# EasyEDA Pro project ProPrj_智能视觉集成板-V1.0.epro, board PCB2_1
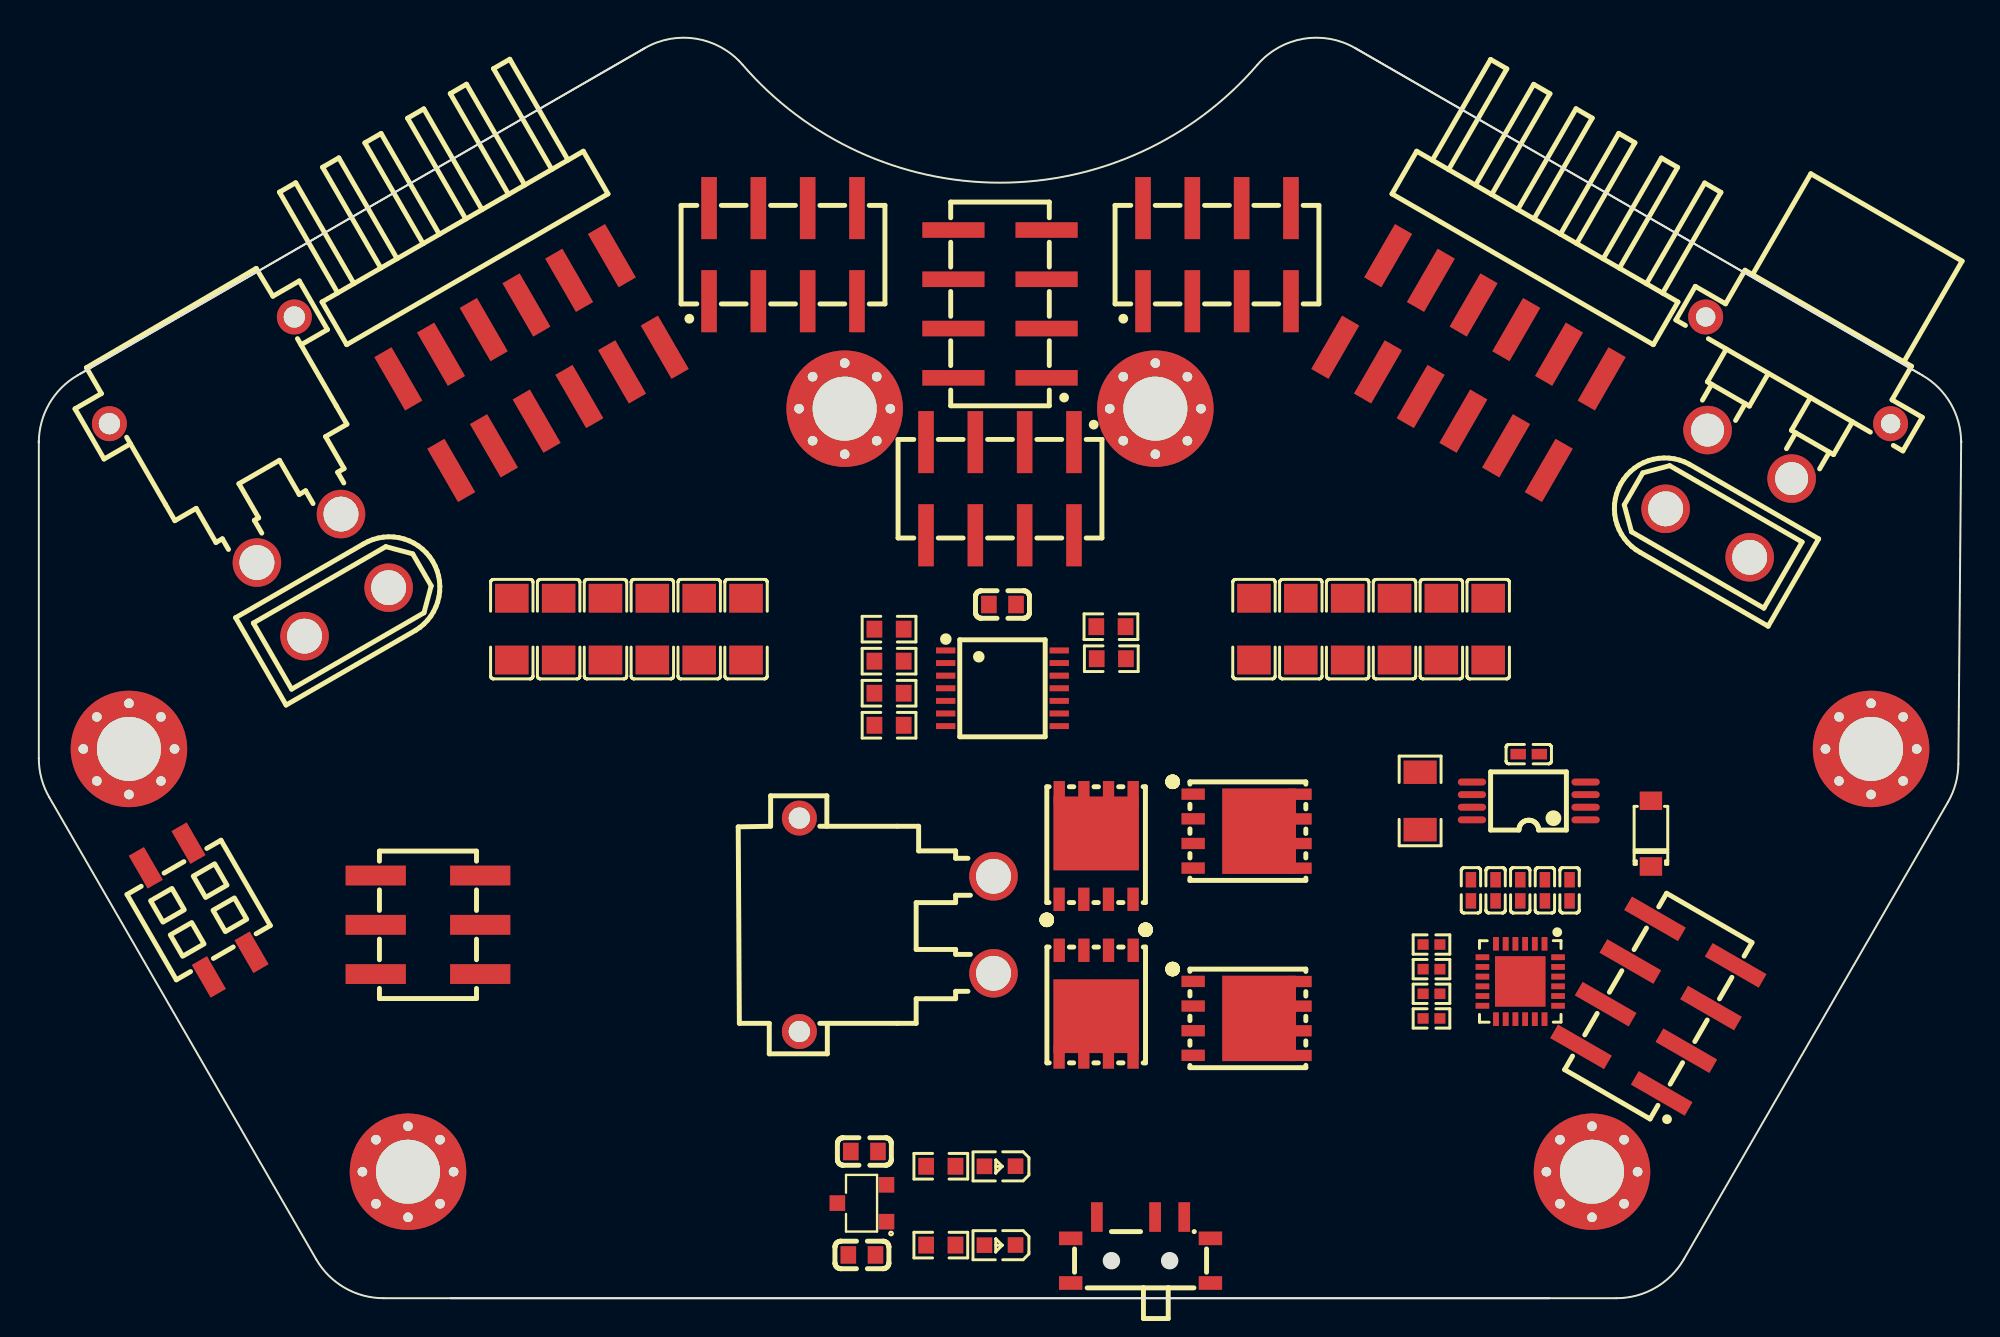
[diagram p12: board, top side]
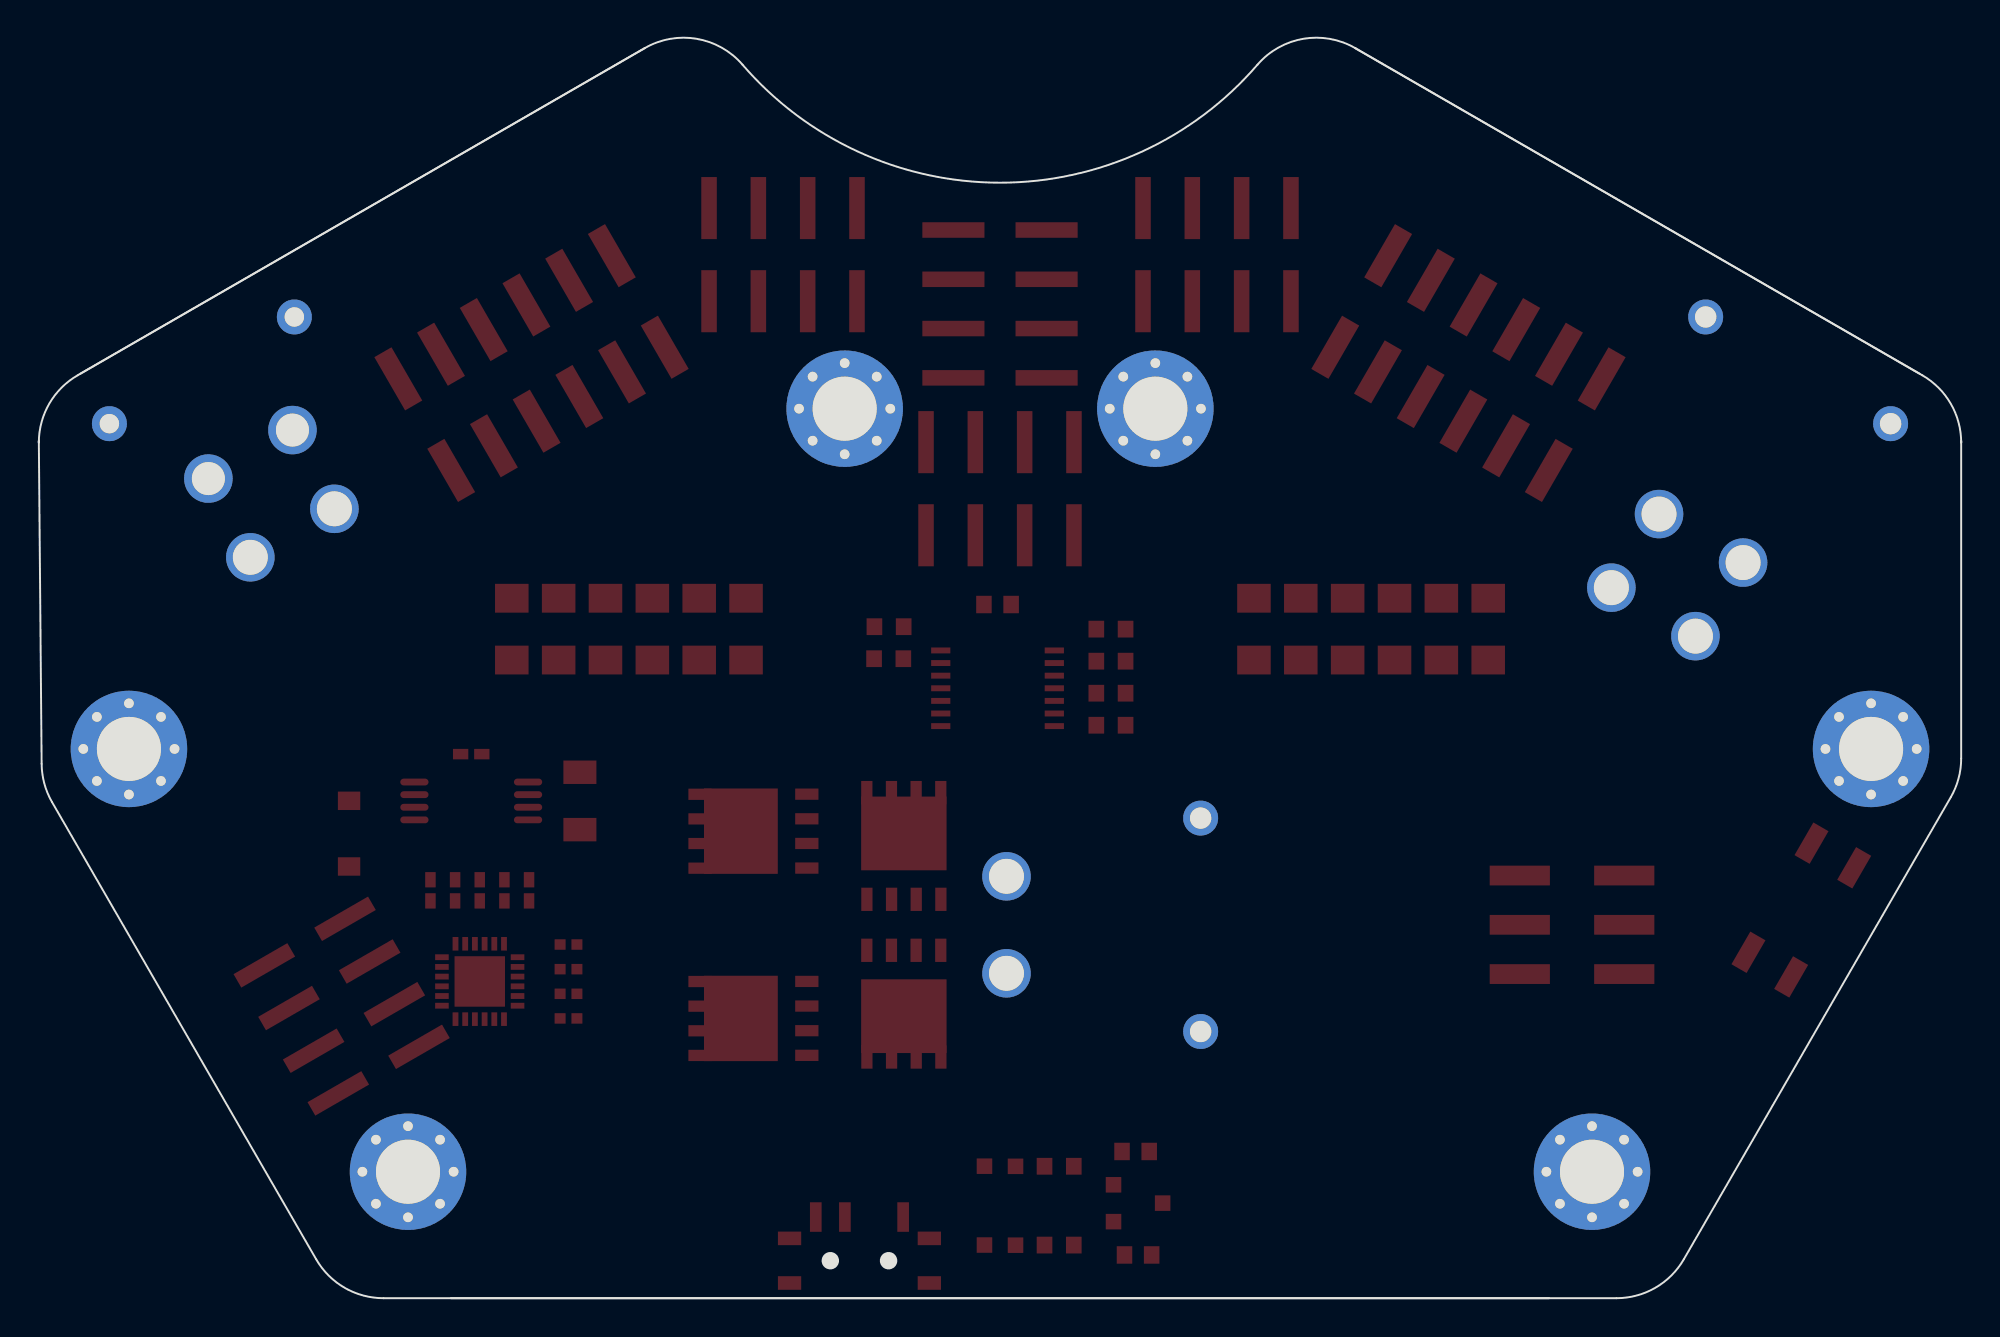
[diagram p13: board, bottom side, seen from below]

Outline 99.01 x 64.92 mm; copper layers: Top Layer, Inner1, Inner2, Inner3, Inner4, Bottom Layer. Coordinates in mm from the lower left corner of the outline.
Outline path: 21.22,0 77.8,0 ; 31.21,64.44 2,47.57 arc(0.54,46.11) 0,44.11 0,44.19 0,27.82 arc(0.14,26.79) 0.54,25.82 14.29,2 arc(15.75,0.54) 17.75,0 81.26,0 arc(83.26,0.54) 84.73,2 98.33,25.57 arc(98.73,26.52) 98.87,27.54 99.01,44.19 99.01,44.11 arc(98.48,46.11) 97.01,47.57 67.8,64.44 ; 31.21,64.44 2.14,47.66 ; 31.21,64.44 arc(33.88,64.92) 36.24,63.58 arc(49.51,57.5) 62.77,63.58 arc(65.13,64.92) 67.8,64.44 ; 67.8,64.44 96.87,47.66
Stack: Top Layer 0.035mm 外层铜厚1oz / Dielectric1 0.0994mm 3313 RC57% 4.2mil / Inner1 0.0152mm 内层铜厚 / Dielectric2 0.55mm 0.55mm H/H No copper / Inner2 0.0152mm 内层铜厚 / Dielectric3 0.1088mm 2116 RC54% 4.9mil / Inner3 0.0152mm 内层铜厚 / Dielectric4 0.55mm 0.55mm H/H No copper / Inner4 0.0152mm 内层铜厚 / Dielectric5 0.0994mm 3313 RC57% 4.2mil / Bottom Layer 0.035mm 外层铜厚1oz

## Design rules (mm)
template: JLCPCB Capability(Two Layers Board)
spacing copperThickness1oz (default): track to track 0.102, other pairs 0.152 to 0.3
spacing copperThickness2oz: track to track 0.203, other pairs 0.152 to 0.3
track width copperThickness1oz (default): min 0.127, default 0.254, max 2.54
track width copperThickness2oz: min 0.203, default 0.254, max 2.54
differential pair differentialPair (default): width min 0.127, default 0.254, max 2.54; gap min 0.152, default 0.152
via viaSize (default): diameter min 0.5, default 0.61, max 10; hole min 0.3, default 0.305, max 6.3

## Placement (name value [footprint] x y rotation side)
C44  1nF  [C0603]  42.4 2.23 180 top
C45  1nF  [C0603]  42.52 7.56 0 top
C94  22uF  [c1206]  69.83 34.49 270 top
C95  22uF  [c1206]  67.41 34.49 270 top
C96  22uF  [c1206]  65 34.49 270 top
C97  22uF  [c1206]  62.59 34.49 270 top
C120  100nF  [C0402]  77.57 21.03 270 top
C121  100nF  [C0402]  78.84 21.03 270 top
C122  100nF  [C0402]  76.3 21.03 270 top
C126  1uF  [C0402]  75.03 21.03 270 top
C127  1uF  [C0402]  73.76 21.03 90 top
C130  100nF  [C0402]  76.74 28.04 0 top
C132  100nF  [C0603]  49.63 35.76 0 top
C133  22uF  [c1206]  74.65 34.49 270 top
C134  22uF  [c1206]  72.24 34.49 270 top
C135  22uF  [c1206]  36.43 34.49 270 top
C136  22uF  [c1206]  34.01 34.49 270 top
C137  22uF  [c1206]  31.6 34.49 270 top
C138  22uF  [c1206]  29.19 34.49 270 top
C139  22uF  [c1206]  26.77 34.49 270 top
C142  22uF  [c1206]  24.36 34.49 270 top
CN6  XT30PW-M30.G.Y  [CONN-TH_XT30PW-M]  10.9 43.5 210 top
CN12  XT30PW-M30.G.Y  [CONN-TH_XT30PW-M]  44.17 19.25 270 top
CN13  PM254-2-04-S-8.5  [HDR-SMD_8P-P2.54-V-F-R2-C4-S7.1]  49.51 41.73 180 top
CN14  PM254-2-04-S-8.5  [HDR-SMD_8P-P2.54-V-F-R2-C4-S7.1]  60.68 53.79 0 top
CN15  PM254-2-04-S-8.5  [HDR-SMD_8P-P2.54-V-F-R2-C4-S7.1]  38.33 53.79 0 top
CN16  PM254-2-04-S-8.5  [HDR-SMD_8P-P2.54-V-F-R2-C4-S7.1]  49.51 51.25 90 top
CN18  PM254-2-04-S-8.5  [HDR-SMD_8P-P2.54-V-F-R2-C4-S7.1]  83.42 15.06 60 top
CN20  XT30UPB-M  [CONN-TH_XT30UPB-M]  85.96 39.44 330 top
CN21  XT30UPB-M  [CONN-TH_XT30UPB-M]  15.85 35.38 210 top
D28  B5819W  [SOD-123_L2.8-W1.8-LS3.7-RD]  83.04 23.95 90 top
J1  -  [M3螺帽]  19.01 6.52 0 top
J2  -  [M3螺帽]  41.51 45.85 0 top
J3  -  [M3螺帽]  57.51 45.85 0 top
J4  -  [M3螺帽]  80 6.52 0 top
J5  -  [M3螺帽]  94.37 28.31 0 top
J6  -  [M3螺帽]  4.64 28.31 0 top
LED4  NCD0603R1  [LED0603-RD_RED]  49.51 6.8 180 top
LED5  NCD0603R1  [LED0603-RD_RED]  49.51 2.74 180 top
Q21  IRFH7440TRPBF  [DFN-8_L5.8-W4.9-P1.27-LS6.0-BL-1]  62.21 24.07 270 top
Q22  IRFH7440TRPBF  [DFN-8_L5.8-W4.9-P1.27-LS6.0-BL-1]  54.46 23.31 0 top
Q23  IRFH7440TRPBF  [DFN-8_L5.8-W4.9-P1.27-LS6.0-BL-1]  62.21 14.42 270 top
Q24  IRFH7440TRPBF  [DFN-8_L5.8-W4.9-P1.27-LS6.0-BL-1]  54.46 15.18 180 top
R68  2.2K  [R0603]  46.46 6.8 180 top
R69  2.2K  [R0603]  46.46 2.74 180 top
R89  100R  [R0603]  43.79 34.49 180 top
R90  100R  [R0603]  43.79 29.53 180 top
R161  10kΩ  [R0402]  71.73 18.23 0 top
R162  10kΩ  [R0402]  71.73 16.96 0 top
R165  1kΩ  [R0402]  71.73 15.69 0 top
R168  33kΩ  [R0402]  71.73 14.42 0 top
R173  10kΩ  [R0603]  43.79 31.19 0 top
R174  10kΩ  [R0603]  43.79 32.84 0 top
R175  10kΩ  [R0603]  55.24 32.96 180 top
R176  10kΩ  [R0603]  55.22 34.61 180 top
SW4  MSK12C02  [SW-TH_MSK12C02]  56.75 2.48 0 top
U10  LR8341A-T33  [SOT-23-3L_L2.9-W1.6-P1.90-LS2.8-BL]  42.4 4.9 90 top
U11  SN74HC125PWR  [TSSOP-14_L5.0-W4.4-P0.65-LS6.5-BL]  49.63 31.44 270 top
U37  100mΩ  [R1206]  71.15 25.63 90 top
U39  DRV8701ERGER  [VQFN-24_L4.0-W4.0-P0.50-BL-EP2.5]  76.3 16.33 180 top
U41  INA240A2PWR  [TSSOP-8_L4.4-W3.0-P0.65-LS6.4-BL]  76.74 25.63 90 top
U56  XT30PW-F20.G.Y  [CONN-TH_XT30PW-F-1]  89.37 45.66 150 top
U57  PZ254-2-06-WS  [HDR-SMD_12P-P2.54_HCTL_PZ254-2-06-WS]  73.64 48.2 150 top
U58  PZ254-2-06-WS  [HDR-SMD_12P-P2.54_HCTL_PZ254-2-06-WS]  25.38 48.2 210 top
U59  DW254S-22-04-85  [HDR-SMD_4P-P2.54-V-F-R2-C2-LS7.0]  8.23 20.01 30 top
编码器1  PZ254-2-03-S  [HDR-SMD_6P-P2.54-V-M-R2-C3-LS7.5-2]  20.04 19.25 270 top

## Footprints (pads in the part's own frame, mm; a bottom-side part is the same pattern mirrored in y, then rotated)
C0402
  rect 0.79x0.54 smd: 1(-0.545,0) 2(0.545,0)
C0603
  rect 0.8x0.9 smd: 1(-0.7,0) 2(0.7,0)
c1206
  rect 1.485x1.728 smd: 1(-1.593,0) 2(1.593,0)
CONN-TH_XT30PW-F-1
  round 2.5 hole 1.7: 1(-2.5,2.5) 2(2.5,2.5)
  round 1.8 hole 1: 3(5.5,-2.5) 4(-5.5,-2.5)
CONN-TH_XT30PW-M
  round 2.5 hole 1.8: 1(-2.5,5) 2(2.5,5)
  round 1.8 hole 1.1: 3(5.5,-5) 4(-5.5,-5)
CONN-TH_XT30UPB-M
  round 2.5 hole 1.8: 1(-2.5,0) 2(2.5,0)
DFN-8_L5.8-W4.9-P1.27-LS6.0-BL-1
  rect 0.58x1.2 smd: 1(-1.907,-2.75) 2(-0.637,-2.75) 3(0.632,-2.75) 4(1.903,-2.75) 5(1.907,2.75) 6(0.637,2.75) 7(-0.632,2.75) 8(-1.903,2.75)
  rect 4.4x3.8 smd: 9(0,0.646)
HDR-SMD_4P-P2.54-V-F-R2-C2-LS7.0
  rect 0.9x1.945 smd: 1(-1.27,-3.248) 2(-1.27,3.247) 3(1.27,-3.247) 4(1.27,3.248)
HDR-SMD_6P-P2.54-V-M-R2-C3-LS7.5-2
  rect 1.02x3.1 smd: 1(-2.54,-2.69) 2(-2.54,2.69) 3(0,-2.69) 4(0,2.69) 5(2.54,-2.69) 6(2.54,2.69)
HDR-SMD_8P-P2.54-V-F-R2-C4-S7.1
  rect 0.8x3.2 smd: 1(-3.81,-2.4) 2(-3.81,2.4) 3(-1.27,-2.4) 4(-1.27,2.4) 5(1.27,-2.4) 6(1.27,2.4) 7(3.81,-2.4) 8(3.81,2.4)
HDR-SMD_12P-P2.54_HCTL_PZ254-2-06-WS
  rect 1.02x3.17 smd: 1(-6.35,-2.725) 2(-6.35,2.725) 3(-3.81,-2.725) 4(-3.81,2.725) 5(-1.27,-2.725) 6(-1.27,2.725) 7(1.27,-2.725) 8(1.27,2.725) 9(3.81,-2.725) 10(3.81,2.725) 11(6.35,-2.725) 12(6.35,2.725)
LED0603-RD_RED
  rect 0.8x0.8 smd: 1(-0.799,-0.004) 2(0.799,0.004)
M3螺帽
  round 6 hole 3.302: 1(0,0)
  round 1 hole 0.5: 2(0,2.349) 3(0,-2.349) 4(2.349,0) 5(-2.349,0) 6(1.651,1.651) 7(-1.651,-1.651) 8(1.651,-1.651) 9(-1.651,1.651)
R0402
  rect 0.566x0.54 smd: 1(-0.433,0) 2(0.433,0)
R0603
  rect 0.806x0.864 smd: 1(-0.753,0) 2(0.753,0)
R1206
  rect 1.208x1.701 smd: 1(-1.479,0) 2(1.479,0)
SOD-123_L2.8-W1.8-LS3.7-RD
  rect 0.95x1.15 smd: 1(-1.692,0) 2(1.692,0)
SOT-23-3L_L2.9-W1.6-P1.90-LS2.8-BL
  rect 0.8x0.8 smd: 1(-0.95,-1.265) 2(0.95,-1.265) 3(0.005,1.265)
SW-TH_MSK12C02
  rect 0.6x1.524 smd: 1(-2.25,1.7) 2(0.75,1.7) 3(2.25,1.7)
  rect 1.2x0.7 smd: 4(-3.6,0.6) 4(-3.6,-1.7) 4(3.6,0.6) 4(3.6,-1.7)
TSSOP-8_L4.4-W3.0-P0.65-LS6.4-BL
  oval 0.353x1.454 smd: 1(-0.975,-2.927) 2(-0.325,-2.927) 3(0.325,-2.927) 4(0.975,-2.927) 5(0.975,2.927) 6(0.325,2.927) 7(-0.325,2.927) 8(-0.975,2.927)
TSSOP-14_L5.0-W4.4-P0.65-LS6.5-BL
  rect 0.305x0.991 smd: 1(-1.95,-2.925) 2(-1.3,-2.925) 3(-0.65,-2.925) 4(0,-2.925) 5(0.65,-2.925) 6(1.3,-2.925) 7(1.95,-2.925) 8(1.95,2.925) 9(1.3,2.925) 10(0.65,2.925) 11(0,2.925) 12(-0.65,2.925) 13(-1.3,2.925) 14(-1.95,2.925)
VQFN-24_L4.0-W4.0-P0.50-BL-EP2.5
  rect 0.3x0.7 smd: 1(-1.25,-1.942) 2(-0.75,-1.942) 3(-0.25,-1.942) 4(0.25,-1.942) 5(0.75,-1.942) 6(1.25,-1.942) 13(1.25,1.942) 14(0.75,1.942) 15(0.25,1.942) 16(-0.25,1.942) 17(-0.75,1.942) 18(-1.25,1.942)
  rect 0.7x0.3 smd: 7(1.948,-1.25) 8(1.948,-0.75) 9(1.948,-0.25) 10(1.948,0.25) 11(1.948,0.75) 12(1.948,1.25) 19(-1.948,1.25) 20(-1.948,0.75) 21(-1.948,0.25) 22(-1.948,-0.25) 23(-1.948,-0.75) 24(-1.948,-1.25)
  rect 2.6x2.6 smd: 25(0.001,-0.001)

## Nets
As in the schematic.

Pads without a net: CN6 3 4; CN12 3 4; CN13 1 2 3 4 5 6 7 8; CN14 1 2 3 4 5 6 7 8; CN15 1 2 3 4 5 6 7 8; CN16 1 2 3 4 5 6 7 8; CN18 1 2 3 4 5 6 7 8; CN20 1 2; CN21 1 2; J1 2 3 4 5 6 7 8 9; J2 2 3 4 5 6 7 8 9; J3 2 3 4 5 6 7 8 9; J4 2 3 4 5 6 7 8 9; J5 2 3 4 5 6 7 8 9; J6 2 3 4 5 6 7 8 9; SW4 1 4; U11 8 11; U39 11; U56 3 4; U59 1 2 3 4; 编码器1 5 6

## Copper pours and planes (outline as drawn; the poured copper is in the pictures)
(no net) on Inner1: 0.4,738.09 1465.65,738.09 1465.65,-694.09 0.4,-694.09
(no net) on Inner3: 0.4,738.09 1465.65,738.09 1465.65,-694.09 0.4,-694.09
